# Altium schematic sheet power_board1.SchDoc
size A3
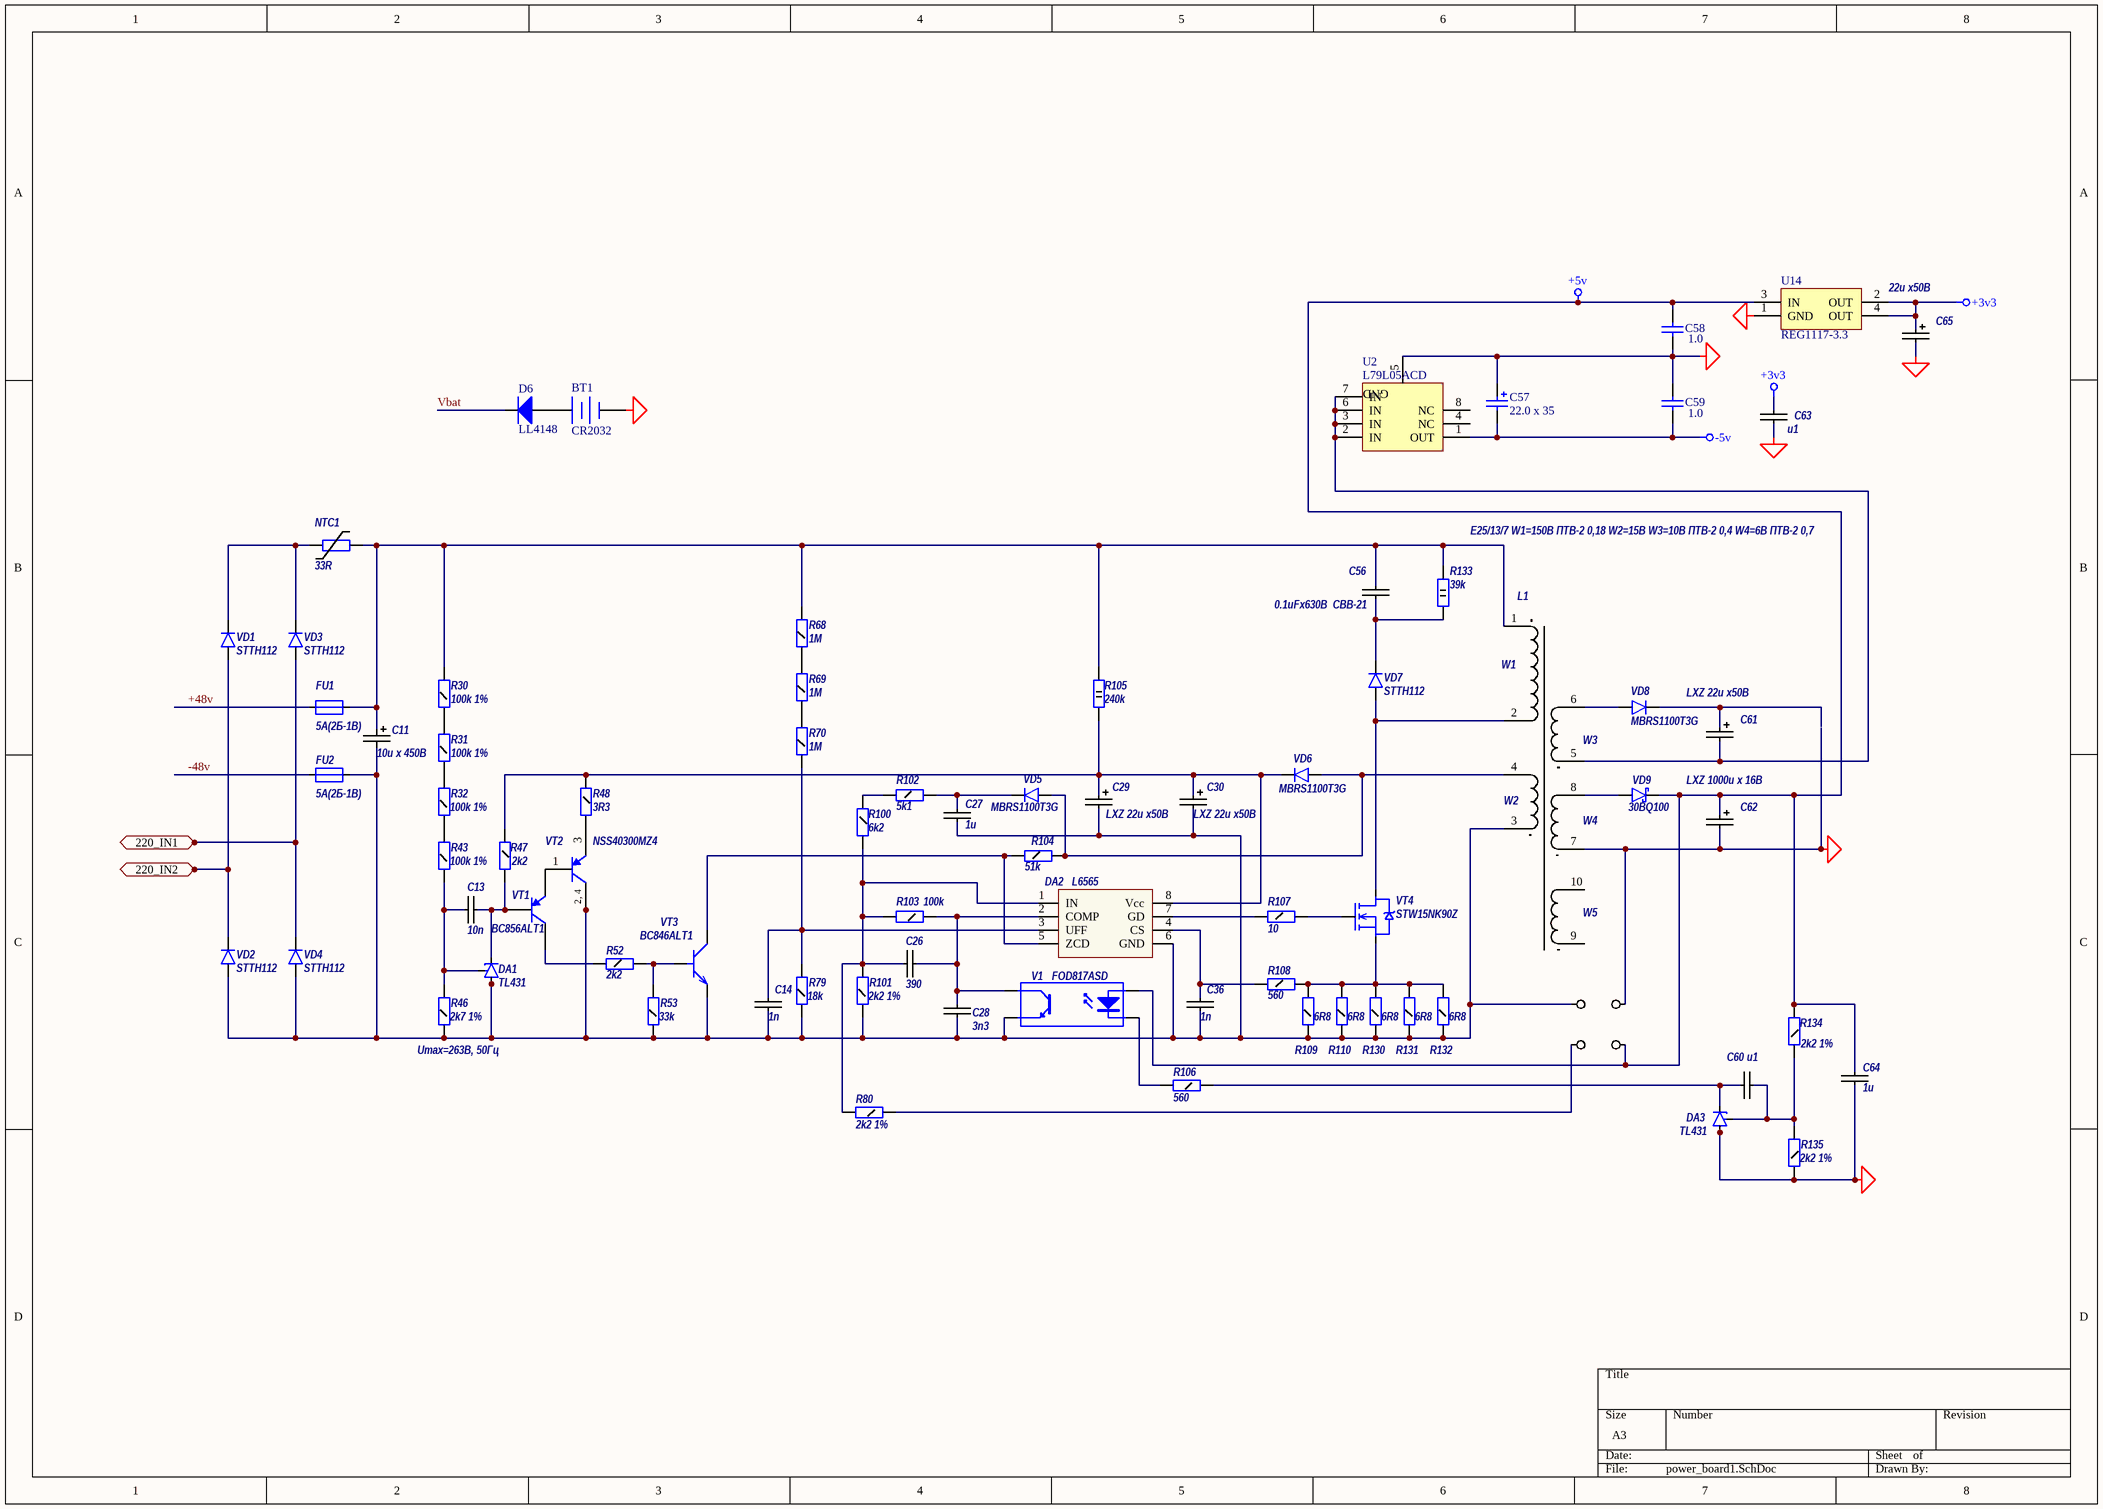
[diagram p0: power_board1.SchDoc]

## Parts
BT1  CR2032  [BAT_SUPP]
C11  10u x 450B  [10uf x 450V]
C13  10n  [_1206]
C14  1n  [_1206]
C26  390  [_1206]
C27  1u  [_1206]
C28  3n3  [_1206]
C29  LXZ 22u x50B  [CAP_POL_6.3x12]
C30  LXZ 22u x50B  [CAP_POL_6.3x12]
C36  1n  [_1206]
C56  0.1uFx630B  CBB-21  [0.1uf *630V]
C57  22.0 x 35  [el3]
C58  1.0  [C3216-1206]
C59  1.0  [C3216-1206]
C60  u1  [_1206]
C61  LXZ 22u x50B  [CAP_POL_6.3x12]
C62  LXZ 1000u x 16B  [CAP_POL_13x21]
C63  u1  [_1206]
C64  1u  [_1206]
C65  22u x50B  [CAP_POL_6.3x12]
D6  LL4148  [_1206d]
DA1  TL431  [SO-G8]
DA2  L6565  [SO-G8]
DA3  TL431  [SO-G8]
FU1  5A(2Б-1В)  [FUSE-3A]
FU2  5A(2Б-1В)  [FUSE-3A]
L1  E25/13/7 W1=150B ПТВ-2 0,18 W2=15B W3=10B ПТВ-2 0,4 W4=6B ПТВ-2 0,7  [Lps_360RH]
NTC1  33R  [NTC 33R]
R30  100k 1%  [_1206]
R31  100k 1%  [_1206]
R32  100k 1%  [_1206]
R43  100k 1%  [_1206]
R46  2k7 1%  [_1206]
R47  2k2  [_1206]
R48  3R3  [_1206]
R52  2k2  [_1206]
R53  33k  [_1206]
R68  1M  [_1206]
R69  1M  [_1206]
R70  1M  [_1206]
R79  18k  [_1206]
R80  2k2 1%  [_1206]
R100  6k2  [_1206]
R101  2k2 1%  [_1206]
R102  5k1  [_1206]
R103  100k  [_1206]
R104  51k  [_1206]
R105  240k  [MF-2 vert]
R106  560  [_1206]
R107  10  [_1206]
R108  560  [_1206]
R109  6R8  [_1206]
R110  6R8  [_1206]
R130  6R8  [_1206]
R131  6R8  [_1206]
R132  6R8  [_1206]
R133  39k  [Res 2W]
R134  2k2 1%  [_1206]
R135  2k2 1%  [_1206]
U2  L79L05ACD  [SO-G8]
U14  REG1117-3.3  [SIP-G3/C7.4]
V1  FOD817ASD  [FOD817ASD]
VD1  STTH112  [10bq*]
VD2  STTH112  [10bq*]
VD3  STTH112  [10bq*]
VD4  STTH112  [10bq*]
VD5  MBRS1100T3G  [10bq*]
VD6  MBRS1100T3G  [10bq*]
VD7  STTH112  [10bq*]
VD8  MBRS1100T3G  [10bq*]
VD9  30BQ100  [30bq*]
VT1  BC856ALT1  [318-08]
VT2  NSS40300MZ4  [SOT223_N]
VT3  BC846ALT1  [SOT-23]
VT4  STW15NK90Z  [IRFP4468_BS]
XP1  PAD  [PAD_otv]  (value not drawn)
XP2  PAD  [PAD_otv]  (value not drawn)
XP3  PAD  [PAD_otv]  (value not drawn)
XP4  PAD  [PAD_otv]  (value not drawn)
XP5  PAD  [PAD_otv]  (value not drawn)
XP6  PAD  [PAD_otv]  (value not drawn)

## Ports
220_IN1, 220_IN2

## Nets
+3v3: C63.1(OA) C65.+ U14.2(OUT) U14.4(OUT)
+5v: C58.2 C62.+ C64.1(OA) R134.2 U14.3(IN) V1.1(A) VD9.2 XP6.1
-5v: C57.2 C59.1 U2.1(OUT)
GND: BT1.2(-) C57.1 C58.1 C59.2 C62.- C63.2(OA) C64.2(OA) C65.- DA3.6 DA3.7 L1.7 R135.1 U2.5(GND) U14.1(GND) XP5.1
220_IN1: VD3.1 VD4.2 XP1.1 ; port 220_IN1
220_IN2: VD1.1 VD2.2 XP2.1 ; port 220_IN2
+48v: FU1.1
-48v: FU2.1
Vbat: D6.2(K)
NetBT1_1: BT1.1(+) D6.1(A)
NetC11_1: C11.1 C56.1(OA) FU1.2 L1.1 NTC1.2 R30.2 R68.2 R105.2 R133.2
NetC11_2: C11.2 C14.2(OA) C27.2(OA) C28.1(OA) C29.- C30.- C36.2(OA) DA1.6 DA1.7 DA2.6(GND) FU2.2 L1.3 R46.1 R53.1 R79.1 R101.1 R109.1 R110.1 R130.1 R131.1 R132.1 V1.3(E) VD2.1 VD4.1 VT2.2(C) VT2.4(C) VT3.2 XP3.1
NetC13_1: C13.1(OA) DA1.8 R43.1 R46.2
NetC13_2: C13.2(OA) DA1.1 R47.2 VT1.1(B)
NetC14_1: C14.1(OA) DA2.3(UFF) R70.1 R79.2
NetC26_1: C26.1(OA) DA2.1(IN) R80.2 R100.2 R101.2 R103.2
NetC26_2: C26.2(OA) C28.2(OA) DA2.2(COMP) R103.1 V1.4(C)
NetC27_1: C27.1(OA) R102.2 VD5.2
NetC29_+: C29.+ C30.+ DA2.8(Vcc) R47.1 R48.1 R105.1 VD6.2
NetC36_1: C36.1(OA) DA2.4(CS) R108.1
NetC56_2: C56.2(OA) R133.1 VD7.2
NetC60_1: C60.1(OA) DA3.1 R106.1
NetC60_2: C60.2(OA) DA3.8 R134.1 R135.2
NetC61_+: C61.+ VD8.2
NetC61_-: C61.- L1.5 U2.2(IN) U2.3(IN) U2.6(IN) U2.7(IN)
NetDA2_5: DA2.5(ZCD) R104.1 VT3.3
NetDA2_7: DA2.7(GD) R107.1
NetL1_2: L1.2 VD7.1 VT4.2(drane)
NetL1_4: L1.4 R104.2 VD5.1 VD6.1
NetL1_6: L1.6 VD8.1
NetL1_8: L1.8 VD9.1
NetNTC1_1: NTC1.1 VD1.2 VD3.2
NetR30_1: R30.1 R31.2
NetR31_1: R31.1 R32.2
NetR32_1: R32.1 R43.2
NetR48_2: R48.2 VT2.3(E)
NetR52_1: R52.1 VT1.3(C)
NetR52_2: R52.2 R53.2 VT3.1
NetR68_1: R68.1 R69.2
NetR69_1: R69.1 R70.2
NetR80_1: R80.1 XP4.1
NetR100_1: R100.1 R102.1
NetR106_2: R106.2 V1.2(K)
NetR107_2: R107.2 VT4.1(gate)
NetR108_2: R108.2 R109.2 R110.2 R130.2 R131.2 R132.2 VT4.3(sourse)
NetVT1_2: VT1.2(E) VT2.1(B)

Not connected (* = marked no-connect by the designer): L1 9 10; U2 4(NC) 8(NC)

## Notes on the sheet
- (near R46) Umax=263B, 50Гц
- (in symbol BSP32) 2, 4
- (in symbol Lps_360RH) W1; W3; W2; W4; W5

## Library data of the parts
BT1 = Battery: Multicell Battery; Manufacturer: Generic Components; Published: 24-Mar-1999; Revision: July-2002: Re-released for DXP Platform.; Publisher: Altium Limited
C11 = 10мкФ х 450В: Power: 450В; Value: 10u x 450B; Feature: Конденсатор
C13 = Capacitor: ManufacturerPartNumber: CC1206 1мкФ±10% 50В X7R; SType: -X7R-50В; Tolerance: 10%; Body: 1206; Docum: PHYCOMP; Type1: C1206; Value: 10n; Feature: Конденсатор; Package: 1206
C14 C26-C28 C36 C60 C64 = Capacitor: Type1: C1206; Tolerance: 10%; SType: -X7R-50B; Docum: PHYCOMP; Pins: 2; Feature: Конденсатор; Package: 1206
  C14 C36: Value: 1n
  C26: Value: 390
  C27 C64: Value: 1u
  C28: Value: 3n3
  C60: Value: u1
C29 C30 C61 = CAP_POL: ManufacturerPartNumber: 22мкФ±20% 50В KMF; SType: -50В; Docum: Nippon Chemi-Con; Type1: EKY; Tolerance: 20%; Value: LXZ 22u x50B; Feature: Конденсатор
C56 = Capacitor: ManufacturerPartNumber: 0.1мкФ±20% 250В; SType: -250В; Docum: ОЖО.461.104 ТУ; Type1: К73-17; Tolerance: 20%; Value: 0.1uFx630B  CBB-21; Feature: Конденсатор
C57 = Cap Pol1: Polarized Capacitor (Radial); Manufacturer: Generic Components; Class I: Passive; Value: 10,0x25; Published: 8-Jun-2000; Revision: July-2002: Re-released for DXP Platform.; Publisher: Altium Limited; Class II: Capacitor
C58 C59 = Cap Semi: Capacitor (Semiconductor SIM Model); Manufacturer: Generic Components; Class I: Passive; Value: 0,1; Published: 8-Jun-2000; Revision: July-2002: Re-released for DXP Platform.; Publisher: Altium Limited; Class II: Capacitor
C62 = 1000 мкФ х 25В: Tolerance: -20 +80%; Type1: Nippon Chemi-Con; SType: -LXY-25B; Value: 1000u; Feature: Конденсатор; Dopvalue: 1000 мкФ х 25В
C63 = Capacitor: Type1: C1206; Tolerance: 10%; Value: 1u; SType: -X7R-50B; Docum: PHYCOMP; Pins: 2; Feature: Конденсатор; Package: 1206
C65 = CAP_POL: ManufacturerPartNumber: 22мкФ±20% 50В KMF; Value: LXZ 22u x50B; SType: -50В; Docum: Nippon Chemi-Con; Type1: EKY; Tolerance: 20%; Feature: Конденсатор
D6 = Diode: Default Diode; Manufacturer: Generic Components; Class I: Discrete; Class II: Diode - Switching; Published: 8-Jun-2000; Revision: July-2002: Re-released for DXP Platform.; Publisher: Altium Limited
DA1 = TL431: Docum: Texas Instruments; Body: SO-8; Feature: Микросхема; Type1: TL431; ManufacturerPartNumber: TL431; Package: SO-8
DA2 = L6565: Docum: ST Microelectronics; Feature: Микросхема
DA3 = TL431: Docum: Texas Instruments; Feature: Микросхема
FU1 FU2 = FUSE: VValue: 5A; Feature: Предохранитель; Value: 5A
L1 = Lps_360RH: Индуктивность
NTC1 = NTC 33R: Позистор; Feature: Позистор
R30 R31 R68 R69 R104 R107-R110 R130-R132 = R1206: Tolerance: 5%; Docum: Bourns; Feature: Резистор; Type1: R1206
  R30 R31: Value: 100k 1%
  R68 R69: Value: 1M
  R104: Value: 51k
  R107: Value: 10
  R108: Value: 560
  R109 R110 R130-R132: Value: 6R8
R32 R43 R80 R101 R134 R135 = R1206: Docum: Bourns; Feature: Резистор; Tolerance: 1%; Type1: R1206
  R32 R43: Value: 100k 1%
  R80 R101 R135: Value: 2k2 1%
  R134: Value: 2k2
R46 = R1206: Value: 1k6; Docum: Bourns; Feature: Резистор; Tolerance: 1%; Type1: R1206
R47 R48 R52 R53 R70 R79 R100 R102 R103 R106 = R1206: Tolerance: 1%; Docum: Bourns; Feature: Резистор; Type1: R1206
  R47 R52: Value: 2k2
  R48: Value: 3R3
  R53: Value: 33k
  R70: Value: 1M
  R79: Value: 18k
  R100: Value: 6k2
  R102: Value: 5k1
  R103: Value: 100k
  R106: Value: 560
R105 = Res 2W: Power/Voltage: 2; Tolerance: 10%; Docum: Hitano; Type1: MF-2; Value: 240k; Feature: Резистор; VValue: 240k
R133 = Res 2W: Value: 100k
U2 = L79L05ACD: Negative Voltage Regulator; Manufacturer: ST-Microelectronics; Package Information: Latest Revision: Jul-1998; Class I: Power Management; Published: 24-Aug-2001; Revision: July-2002: Re-released for DXP Platform.; Datasheet: Latest Revision: Apr-1999; Package Reference: SO8; Publisher: Altium Limited; Class II: Voltage Regulator
U14 = REG1117-3.3: 800mA and 1A Low Dropout Positive Regulator 2.85V, 3.3V, 5V, and Adjustable; Manufacturer: Burr-Brown; Package Information: Latest Revision: Rev. C; Class I: Power Management; Class II: Voltage Regulator; Published: 8-Jun-2000; Revision: July-2002: Re-released for DXP Platform.; Datasheet: Latest Revision: Sep-1997; Package Reference: ZZ311; Publisher: Altium Limited
V1 = FOD817ASD: Docum: Fairchild Semiconductor; Feature: Оптопара; Type1: FOD817ASD
VD1-VD4 VD7 = DIOD_2: ManufacturerPartNumber: STTH2R060U; Docum: ST Microelectronics; Body: SMB; Feature: Диод; Type1: STTH112; Package: SMB
VD5 VD6 VD8 = DIOD_1: Docum: ON Semiconductor; Feature: Диод; Type1: MBRS1100T3G
VD9 = DIOD_SH: Docum: International Rectifier; Body: SMC; Feature: Диод; Type1: 30BQ100; ManufacturerPartNumber: 30BQ100; Package: SMC
VT1 = BC856ALT1: General Purpose Transistor PNP Silicon; Manufacturer: ON Semiconductor; Body: SOT-23; Published: 29-Sep-2000; LatestRevisionDate: 17-Jul-2002; LatestRevisionNote: Re-released for DXP Platform.; DatasheetVersion: 1997; PackageVersion: 1997; PackageReference: 318-08; Publisher: Altium Limited; PackageDescription: SOT-23; 3 Leads; Body 3.0 x 2.6 mm, inc. leads (LxW max); ComponentLink1Description: Manufacturer Link; ComponentLink1URL: http://www.onsemi.com/site/products/landing?taxonomyID=194; ComponentLink2Description: Datasheet; ComponentLink2URL: http://www.onsemi.com/pub/Collateral/BC856ALT1-D.PDF; Value: BC856ALT1; Feature: Транзистор; Manufacturer Number: BC856ALT1
VT2 = BSP32: Транзистор; Производитель: ON Semiconductor; Published: 17-Sep-2003; LatestRevisionDate: 12-Dec-2006; LatestRevisionNote: IPC-7351 Footprint Added.; DatasheetVersion: 26-Apr-1999; PackageVersion: Aug-2001; PackageReference: SOT223; Publisher: Altium Limited; PackageDescription: 4-Pin SOT-223 Package 2.3 mm Pitch, 7 mm Lead Span; ComponentLink1URL: http://www.semiconductors.philips.com/; ComponentLink2Description: Datasheet; ComponentLink2URL: http://www.semiconductors.philips.com/acrobat/datasheets/BSP31_32_33_3.pdf; Feature: Транзистор; Type1: NSS40300MZ4
VT3 = TRANS_npn: Docum: ON Semiconductor; Feature: Транзистор; Type1: BC846ALT1; Body: SOT-23; ManufacturerPartNumber: BC846ALT1; Package: SOT-23
VT4 = irfp4468_otv: Manufacturer: International Rectifier; Body: TO-247AC; Value: IRFP4468; Feature: Транзистор; Manufacturer Number: IRFP4468